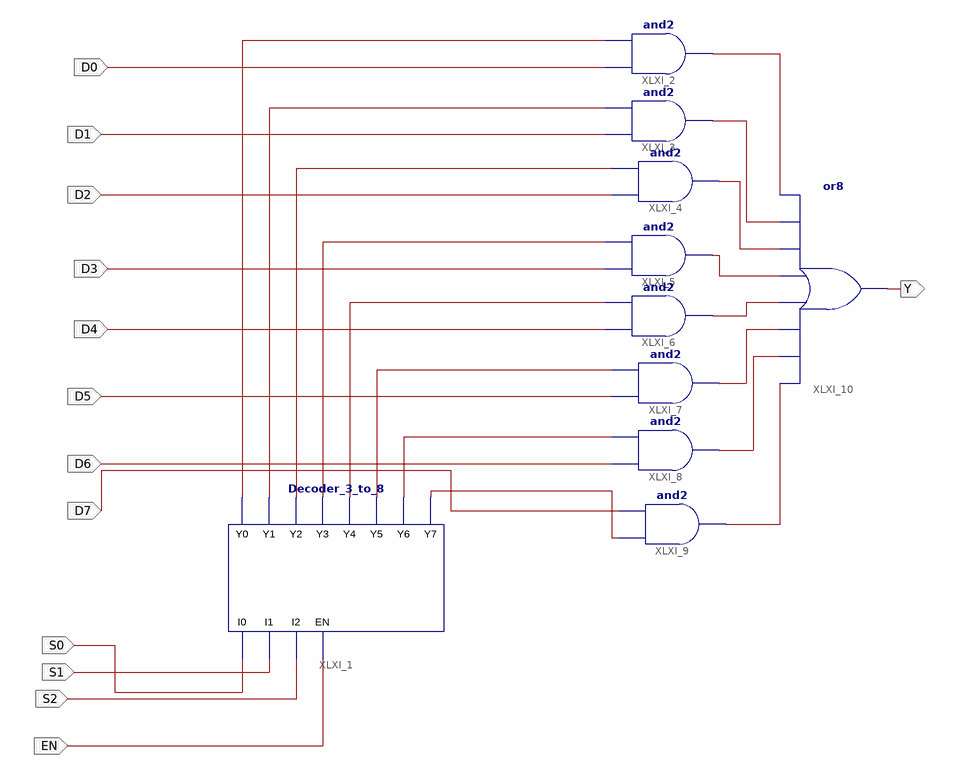
[diagram p0: schematic sheet 1]
// Xilinx ISE schematic Mux_8_to_1.sch (spartan3e) as structural Verilog: 10 symbols, 13 ports
module Mux_8_to_1 (
  input  D0,
  input  D1,
  input  D2,
  input  D3,
  input  D4,
  input  D5,
  input  D6,
  input  D7,
  input  S0,
  input  S1,
  input  S2,
  input  EN,
  output Y
);

  wire XLXN_1, XLXN_2, XLXN_3, XLXN_4, XLXN_7, XLXN_8, XLXN_9, XLXN_10, XLXN_29, XLXN_30, XLXN_31, XLXN_33,
       XLXN_34, XLXN_35, XLXN_37, XLXN_38;

  Decoder_3_to_8 XLXI_1 (
    .I0(S0), .I1(S1), .I2(S2), .EN(EN), .Y0(XLXN_1), .Y1(XLXN_2), .Y2(XLXN_3), .Y3(XLXN_4), .Y4(XLXN_7),
    .Y5(XLXN_8), .Y6(XLXN_9), .Y7(XLXN_10));
  and XLXI_2 (XLXN_29, D0, XLXN_1);
  and XLXI_3 (XLXN_30, D1, XLXN_2);
  and XLXI_4 (XLXN_31, D2, XLXN_3);
  and XLXI_5 (XLXN_33, D3, XLXN_4);
  and XLXI_6 (XLXN_34, D4, XLXN_7);
  and XLXI_7 (XLXN_35, D5, XLXN_8);
  and XLXI_8 (XLXN_37, D6, XLXN_9);
  and XLXI_9 (XLXN_38, XLXN_10, D7);
  or XLXI_10 (Y, XLXN_38, XLXN_37, XLXN_35, XLXN_34, XLXN_33, XLXN_31, XLXN_30, XLXN_29);
endmodule
